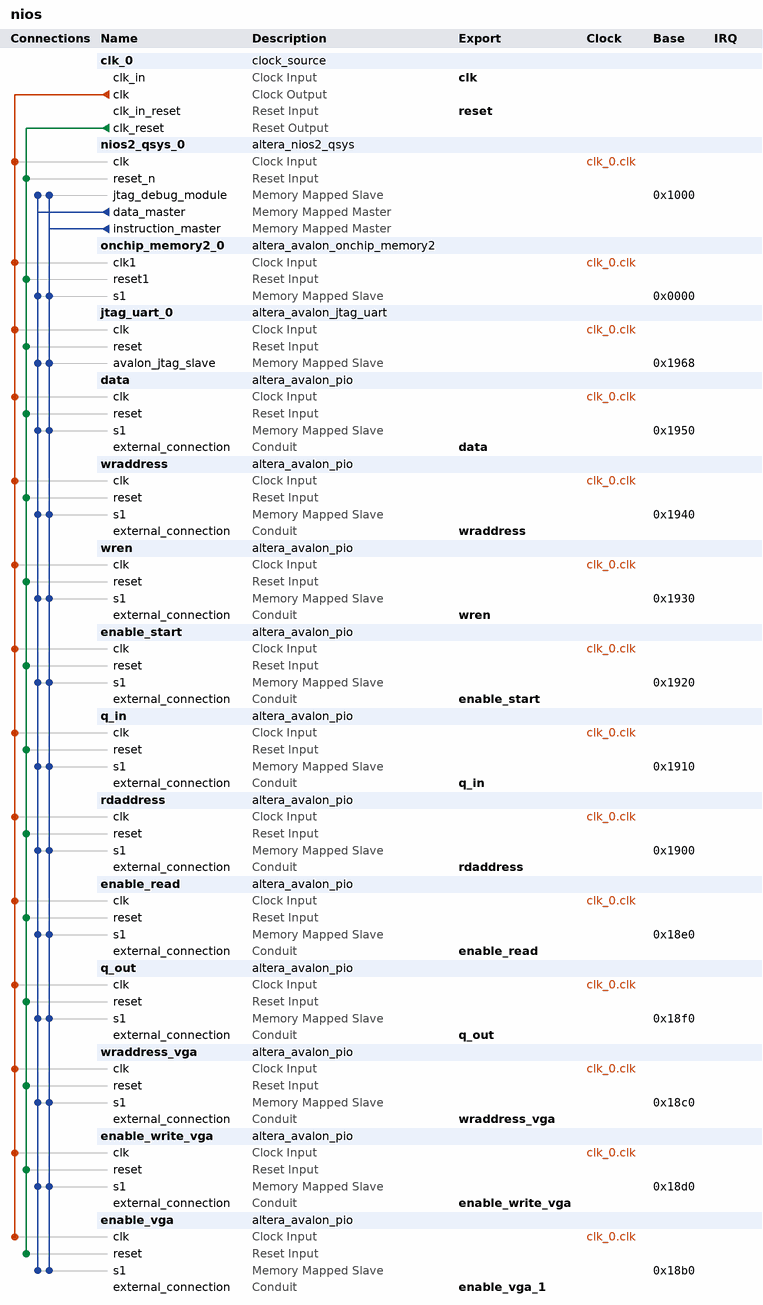
[diagram p0: system contents]
# Platform Designer (Qsys) system nios, Cyclone IV E EP4CE30F23C7
# Parameters at their usual value, and those the tool derives, are not listed.
package require -exact qsys 13.0.1.99.2
create_system nios
set_project_property DEVICE_FAMILY {Cyclone IV E}
set_project_property DEVICE EP4CE30F23C7

add_instance clk_0 clock_source 13.0
set_instance_parameter_value clk_0 clockFrequency 50000000

add_instance nios2_qsys_0 altera_nios2_qsys 13.0
set_instance_parameter_value nios2_qsys_0 resetSlave onchip_memory2_0.s1
set_instance_parameter_value nios2_qsys_0 mmu_TLBMissExcSlave None
set_instance_parameter_value nios2_qsys_0 exceptionSlave onchip_memory2_0.s1
set_instance_parameter_value nios2_qsys_0 breakSlave nios2_qsys_0.jtag_debug_module
set_instance_parameter_value nios2_qsys_0 impl Tiny
set_instance_parameter_value nios2_qsys_0 icache_size 4096

add_instance onchip_memory2_0 altera_avalon_onchip_memory2 13.0.1.99.2
set_instance_parameter_value onchip_memory2_0 dataWidth 32
set_instance_parameter_value onchip_memory2_0 dualPort false
set_instance_parameter_value onchip_memory2_0 initMemContent true
set_instance_parameter_value onchip_memory2_0 initializationFileName onchip_mem.hex
set_instance_parameter_value onchip_memory2_0 memorySize 2048
set_instance_parameter_value onchip_memory2_0 useNonDefaultInitFile true

add_instance jtag_uart_0 altera_avalon_jtag_uart 13.0.1.99.2
set_instance_parameter_value jtag_uart_0 simInteractiveOptions NO_INTERACTIVE_WINDOWS

add_instance data altera_avalon_pio 13.0.1.99.2
set_instance_parameter_value data direction Output
set_instance_parameter_value data width 8

add_instance wraddress altera_avalon_pio 13.0.1.99.2
set_instance_parameter_value wraddress direction Output
set_instance_parameter_value wraddress width 12

add_instance wren altera_avalon_pio 13.0.1.99.2
set_instance_parameter_value wren direction Output
set_instance_parameter_value wren width 1

add_instance enable_start altera_avalon_pio 13.0.1.99.2
set_instance_parameter_value enable_start direction Output
set_instance_parameter_value enable_start width 1

add_instance q_in altera_avalon_pio 13.0.1.99.2
set_instance_parameter_value q_in direction Input
set_instance_parameter_value q_in width 1

add_instance rdaddress altera_avalon_pio 13.0.1.99.2
set_instance_parameter_value rdaddress direction Output
set_instance_parameter_value rdaddress width 12

add_instance enable_read altera_avalon_pio 13.0.1.99.2
set_instance_parameter_value enable_read direction Input
set_instance_parameter_value enable_read width 1

add_instance q_out altera_avalon_pio 13.0.1.99.2
set_instance_parameter_value q_out direction Output
set_instance_parameter_value q_out width 1

add_instance wraddress_vga altera_avalon_pio 13.0.1.99.2
set_instance_parameter_value wraddress_vga direction Output
set_instance_parameter_value wraddress_vga width 12

add_instance enable_write_vga altera_avalon_pio 13.0.1.99.2
set_instance_parameter_value enable_write_vga direction Output
set_instance_parameter_value enable_write_vga width 1

add_instance enable_vga altera_avalon_pio 13.0.1.99.2
set_instance_parameter_value enable_vga direction Output
set_instance_parameter_value enable_vga width 1

# connections
add_connection clk_0.clk data.clk clock
add_connection clk_0.clk enable_read.clk clock
add_connection clk_0.clk enable_start.clk clock
add_connection clk_0.clk enable_vga.clk clock
add_connection clk_0.clk enable_write_vga.clk clock
add_connection clk_0.clk jtag_uart_0.clk clock
add_connection clk_0.clk nios2_qsys_0.clk clock
add_connection clk_0.clk onchip_memory2_0.clk1 clock
add_connection clk_0.clk q_in.clk clock
add_connection clk_0.clk q_out.clk clock
add_connection clk_0.clk rdaddress.clk clock
add_connection clk_0.clk wraddress.clk clock
add_connection clk_0.clk wraddress_vga.clk clock
add_connection clk_0.clk wren.clk clock
add_connection clk_0.clk_reset data.reset reset
add_connection clk_0.clk_reset enable_read.reset reset
add_connection clk_0.clk_reset enable_start.reset reset
add_connection clk_0.clk_reset enable_vga.reset reset
add_connection clk_0.clk_reset enable_write_vga.reset reset
add_connection clk_0.clk_reset jtag_uart_0.reset reset
add_connection clk_0.clk_reset nios2_qsys_0.reset_n reset
add_connection clk_0.clk_reset onchip_memory2_0.reset1 reset
add_connection clk_0.clk_reset q_in.reset reset
add_connection clk_0.clk_reset q_out.reset reset
add_connection clk_0.clk_reset rdaddress.reset reset
add_connection clk_0.clk_reset wraddress.reset reset
add_connection clk_0.clk_reset wraddress_vga.reset reset
add_connection clk_0.clk_reset wren.reset reset
add_connection nios2_qsys_0.data_master data.s1 avalon
set_connection_parameter_value nios2_qsys_0.data_master/data.s1 baseAddress 0x1950
add_connection nios2_qsys_0.data_master enable_read.s1 avalon
set_connection_parameter_value nios2_qsys_0.data_master/enable_read.s1 baseAddress 0x18e0
add_connection nios2_qsys_0.data_master enable_start.s1 avalon
set_connection_parameter_value nios2_qsys_0.data_master/enable_start.s1 baseAddress 0x1920
add_connection nios2_qsys_0.data_master enable_vga.s1 avalon
set_connection_parameter_value nios2_qsys_0.data_master/enable_vga.s1 baseAddress 0x18b0
add_connection nios2_qsys_0.data_master enable_write_vga.s1 avalon
set_connection_parameter_value nios2_qsys_0.data_master/enable_write_vga.s1 baseAddress 0x18d0
add_connection nios2_qsys_0.data_master jtag_uart_0.avalon_jtag_slave avalon
set_connection_parameter_value nios2_qsys_0.data_master/jtag_uart_0.avalon_jtag_slave baseAddress 0x1968
add_connection nios2_qsys_0.data_master nios2_qsys_0.jtag_debug_module avalon
set_connection_parameter_value nios2_qsys_0.data_master/nios2_qsys_0.jtag_debug_module baseAddress 0x1000
add_connection nios2_qsys_0.data_master onchip_memory2_0.s1 avalon
set_connection_parameter_value nios2_qsys_0.data_master/onchip_memory2_0.s1 baseAddress 0x0000
add_connection nios2_qsys_0.data_master q_in.s1 avalon
set_connection_parameter_value nios2_qsys_0.data_master/q_in.s1 baseAddress 0x1910
add_connection nios2_qsys_0.data_master q_out.s1 avalon
set_connection_parameter_value nios2_qsys_0.data_master/q_out.s1 baseAddress 0x18f0
add_connection nios2_qsys_0.data_master rdaddress.s1 avalon
set_connection_parameter_value nios2_qsys_0.data_master/rdaddress.s1 baseAddress 0x1900
add_connection nios2_qsys_0.data_master wraddress.s1 avalon
set_connection_parameter_value nios2_qsys_0.data_master/wraddress.s1 baseAddress 0x1940
add_connection nios2_qsys_0.data_master wraddress_vga.s1 avalon
set_connection_parameter_value nios2_qsys_0.data_master/wraddress_vga.s1 baseAddress 0x18c0
add_connection nios2_qsys_0.data_master wren.s1 avalon
set_connection_parameter_value nios2_qsys_0.data_master/wren.s1 baseAddress 0x1930
add_connection nios2_qsys_0.instruction_master data.s1 avalon
set_connection_parameter_value nios2_qsys_0.instruction_master/data.s1 baseAddress 0x1950
add_connection nios2_qsys_0.instruction_master enable_read.s1 avalon
set_connection_parameter_value nios2_qsys_0.instruction_master/enable_read.s1 baseAddress 0x18e0
add_connection nios2_qsys_0.instruction_master enable_start.s1 avalon
set_connection_parameter_value nios2_qsys_0.instruction_master/enable_start.s1 baseAddress 0x1920
add_connection nios2_qsys_0.instruction_master enable_vga.s1 avalon
set_connection_parameter_value nios2_qsys_0.instruction_master/enable_vga.s1 baseAddress 0x18b0
add_connection nios2_qsys_0.instruction_master enable_write_vga.s1 avalon
set_connection_parameter_value nios2_qsys_0.instruction_master/enable_write_vga.s1 baseAddress 0x18d0
add_connection nios2_qsys_0.instruction_master jtag_uart_0.avalon_jtag_slave avalon
set_connection_parameter_value nios2_qsys_0.instruction_master/jtag_uart_0.avalon_jtag_slave baseAddress 0x1968
add_connection nios2_qsys_0.instruction_master nios2_qsys_0.jtag_debug_module avalon
set_connection_parameter_value nios2_qsys_0.instruction_master/nios2_qsys_0.jtag_debug_module baseAddress 0x1000
add_connection nios2_qsys_0.instruction_master onchip_memory2_0.s1 avalon
set_connection_parameter_value nios2_qsys_0.instruction_master/onchip_memory2_0.s1 baseAddress 0x0000
add_connection nios2_qsys_0.instruction_master q_in.s1 avalon
set_connection_parameter_value nios2_qsys_0.instruction_master/q_in.s1 baseAddress 0x1910
add_connection nios2_qsys_0.instruction_master q_out.s1 avalon
set_connection_parameter_value nios2_qsys_0.instruction_master/q_out.s1 baseAddress 0x18f0
add_connection nios2_qsys_0.instruction_master rdaddress.s1 avalon
set_connection_parameter_value nios2_qsys_0.instruction_master/rdaddress.s1 baseAddress 0x1900
add_connection nios2_qsys_0.instruction_master wraddress.s1 avalon
set_connection_parameter_value nios2_qsys_0.instruction_master/wraddress.s1 baseAddress 0x1940
add_connection nios2_qsys_0.instruction_master wraddress_vga.s1 avalon
set_connection_parameter_value nios2_qsys_0.instruction_master/wraddress_vga.s1 baseAddress 0x18c0
add_connection nios2_qsys_0.instruction_master wren.s1 avalon
set_connection_parameter_value nios2_qsys_0.instruction_master/wren.s1 baseAddress 0x1930

# exported interfaces
add_interface clk clock sink
set_interface_property clk EXPORT_OF clk_0.clk_in
add_interface reset reset sink
set_interface_property reset EXPORT_OF clk_0.clk_in_reset
add_interface data conduit end
set_interface_property data EXPORT_OF data.external_connection
add_interface wraddress conduit end
set_interface_property wraddress EXPORT_OF wraddress.external_connection
add_interface wren conduit end
set_interface_property wren EXPORT_OF wren.external_connection
add_interface enable_start conduit end
set_interface_property enable_start EXPORT_OF enable_start.external_connection
add_interface q_in conduit end
set_interface_property q_in EXPORT_OF q_in.external_connection
add_interface rdaddress conduit end
set_interface_property rdaddress EXPORT_OF rdaddress.external_connection
add_interface enable_read conduit end
set_interface_property enable_read EXPORT_OF enable_read.external_connection
add_interface wraddress_vga conduit end
set_interface_property wraddress_vga EXPORT_OF wraddress_vga.external_connection
add_interface enable_write_vga conduit end
set_interface_property enable_write_vga EXPORT_OF enable_write_vga.external_connection
add_interface q_out conduit end
set_interface_property q_out EXPORT_OF q_out.external_connection
add_interface enable_vga_1 conduit end
set_interface_property enable_vga_1 EXPORT_OF enable_vga.external_connection

set_interconnect_requirement {$system} qsys_mm.clockCrossingAdapter HANDSHAKE
set_interconnect_requirement {$system} qsys_mm.maxAdditionalLatency 1

save_system nios.qsys
